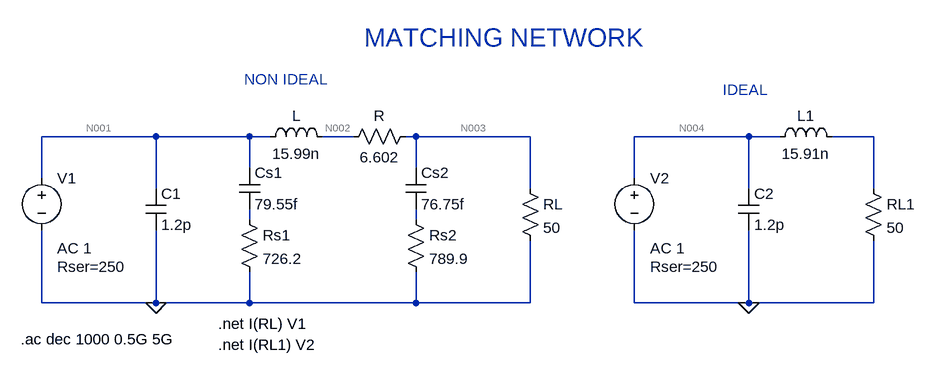
[diagram p0: schematic matching_cir.asc]
matching_cir.asc, the LTspice schematic file:
Version 4
SHEET 1 1444 680
WIRE -96 48 -272 48
WIRE 48 48 -96 48
WIRE 80 48 48 48
WIRE 208 48 160 48
WIRE 304 48 288 48
WIRE 480 48 304 48
WIRE 816 48 640 48
WIRE 864 48 816 48
WIRE 1008 48 944 48
WIRE 48 96 48 48
WIRE 304 96 304 48
WIRE -272 112 -272 48
WIRE 640 112 640 48
WIRE -96 128 -96 48
WIRE 480 128 480 48
WIRE 816 128 816 48
WIRE 1008 128 1008 48
WIRE 48 176 48 160
WIRE 304 176 304 160
WIRE -272 304 -272 192
WIRE -96 304 -96 192
WIRE -96 304 -272 304
WIRE 48 304 48 256
WIRE 48 304 -96 304
WIRE 304 304 304 256
WIRE 304 304 48 304
WIRE 480 304 480 208
WIRE 480 304 304 304
WIRE 640 304 640 192
WIRE 816 304 816 192
WIRE 816 304 640 304
WIRE 1008 304 1008 208
WIRE 1008 304 816 304
FLAG -96 304 0
FLAG 816 304 0
SYMBOL ind 64 64 R270
WINDOW 0 32 56 VTop 2
WINDOW 3 5 56 VBottom 2
SYMATTR InstName L
SYMATTR Value 15.99n
SYMBOL res 304 32 R90
WINDOW 0 0 56 VBottom 2
WINDOW 3 32 56 VTop 2
SYMATTR InstName R
SYMATTR Value 6.602
SYMBOL cap 32 96 R0
SYMATTR InstName Cs1
SYMATTR Value 79.55f
SYMBOL cap 288 96 R0
SYMATTR InstName Cs2
SYMATTR Value 76.75f
SYMBOL res 32 160 R0
SYMATTR InstName Rs1
SYMATTR Value 726.2
SYMBOL res 288 160 R0
SYMATTR InstName Rs2
SYMATTR Value 789.9
SYMBOL res 464 112 R0
SYMATTR InstName RL
SYMATTR Value 50
SYMBOL cap -112 128 R0
SYMATTR InstName C1
SYMATTR Value 1.2p
SYMBOL voltage -272 96 R0
WINDOW 123 24 124 Left 2
WINDOW 39 24 152 Left 2
SYMATTR Value2 AC 1
SYMATTR SpiceLine Rser=250
SYMATTR InstName V1
SYMATTR Value ""
SYMBOL ind 848 64 R270
WINDOW 0 32 56 VTop 2
WINDOW 3 5 56 VBottom 2
SYMATTR InstName L1
SYMATTR Value 15.91n
SYMBOL res 992 112 R0
SYMATTR InstName RL1
SYMATTR Value 50
SYMBOL cap 800 128 R0
SYMATTR InstName C2
SYMATTR Value 1.2p
SYMBOL voltage 640 96 R0
WINDOW 123 24 124 Left 2
WINDOW 39 24 152 Left 2
SYMATTR Value2 AC 1
SYMATTR SpiceLine Rser=250
SYMATTR InstName V2
SYMATTR Value ""
TEXT 0 336 Left 2 !.net I(RL) V1
TEXT -304 360 Left 2 !.ac dec 1000 0.5G 5G
TEXT 40 -40 Left 2 ;NON IDEAL
TEXT 776 -24 Left 2 ;IDEAL
TEXT 224 -104 Left 4 ;MATCHING NETWORK
TEXT 0 368 Left 2 !.net I(RL1) V2

The netlist it stands for:
* matching_cir.asc
L N001 N002 15.99n
R N003 N002 6.602
Cs1 N001 N006 79.55f
Cs2 N003 N007 76.75f
Rs1 N006 0 726.2
Rs2 N007 0 789.9
RL N003 0 50
C1 N001 0 1.2p
V1 N001 0 AC 1 Rser=250
L1 N004 N005 15.91n
RL1 N005 0 50
C2 N004 0 1.2p
V2 N004 0 AC 1 Rser=250
.net I(RL) V1
.ac dec 1000 0.5G 5G
* NON IDEAL
* IDEAL
* MATCHING NETWORK
.net I(RL1) V2
.backanno
.end

* Results of the author's LTspice run, read from the files saved beside the schematic
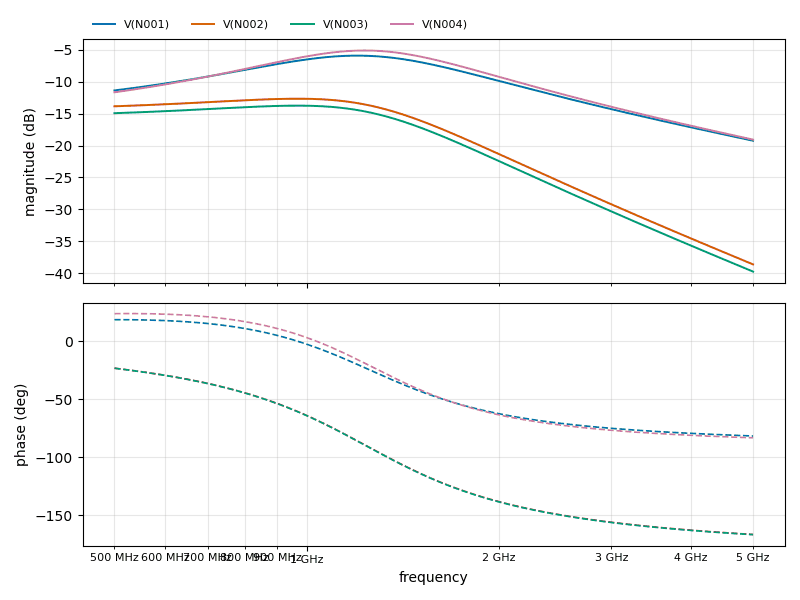
[diagram p1: AC Analysis of matching_cir.asc, plotted from the saved traces]
* AC Analysis, 1 run:
*   V(N001): -11.37 dB at 500 MHz, -19.25 dB at 5 GHz, peak -5.92 dB at 1.199 GHz, 3 dB below the peak at 724.7 MHz and 1.837 GHz
*   V(N002): -13.86 dB at 500 MHz, -38.62 dB at 5 GHz, peak -12.67 dB at 968.2 MHz, 3 dB below the peak at 1.467 GHz
*   V(N003): -14.94 dB at 500 MHz, -39.74 dB at 5 GHz, peak -13.76 dB at 966 MHz, 3 dB below the peak at 1.467 GHz
*   V(N004): -11.67 dB at 500 MHz, -19.08 dB at 5 GHz, peak -5.12 dB at 1.233 GHz, 3 dB below the peak at 790 MHz and 1.824 GHz